# EAGLE schematic CrowPanel Pico Display-3.5_V1.0-240412 (EAGLE 9.6.2)
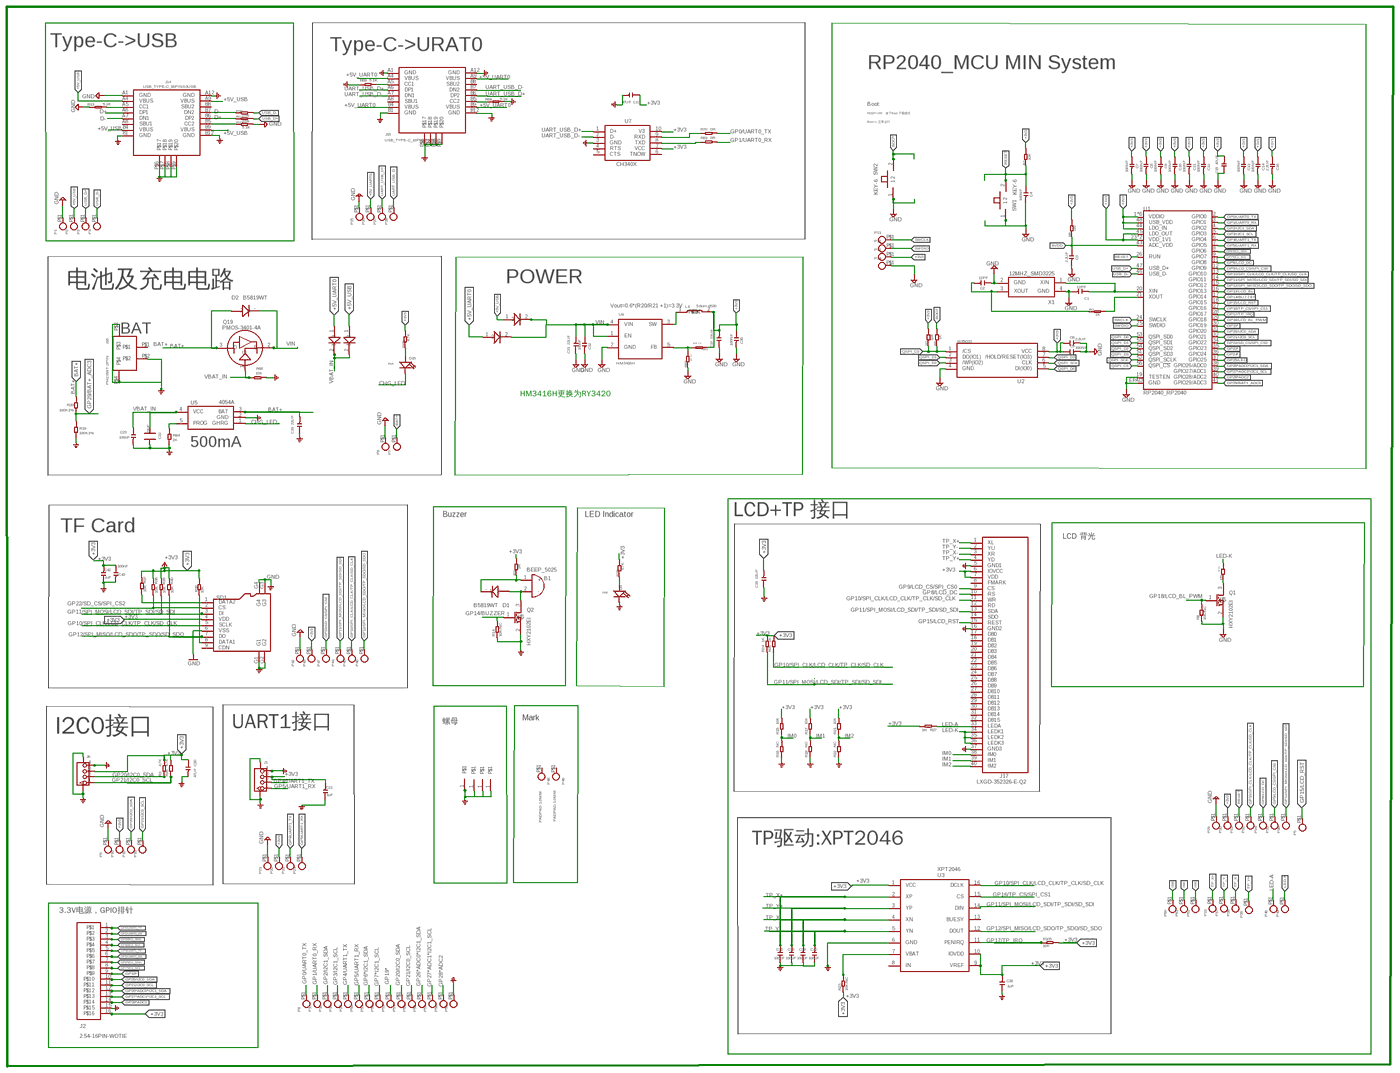
[diagram p0: schematic, sheet 1, overview]
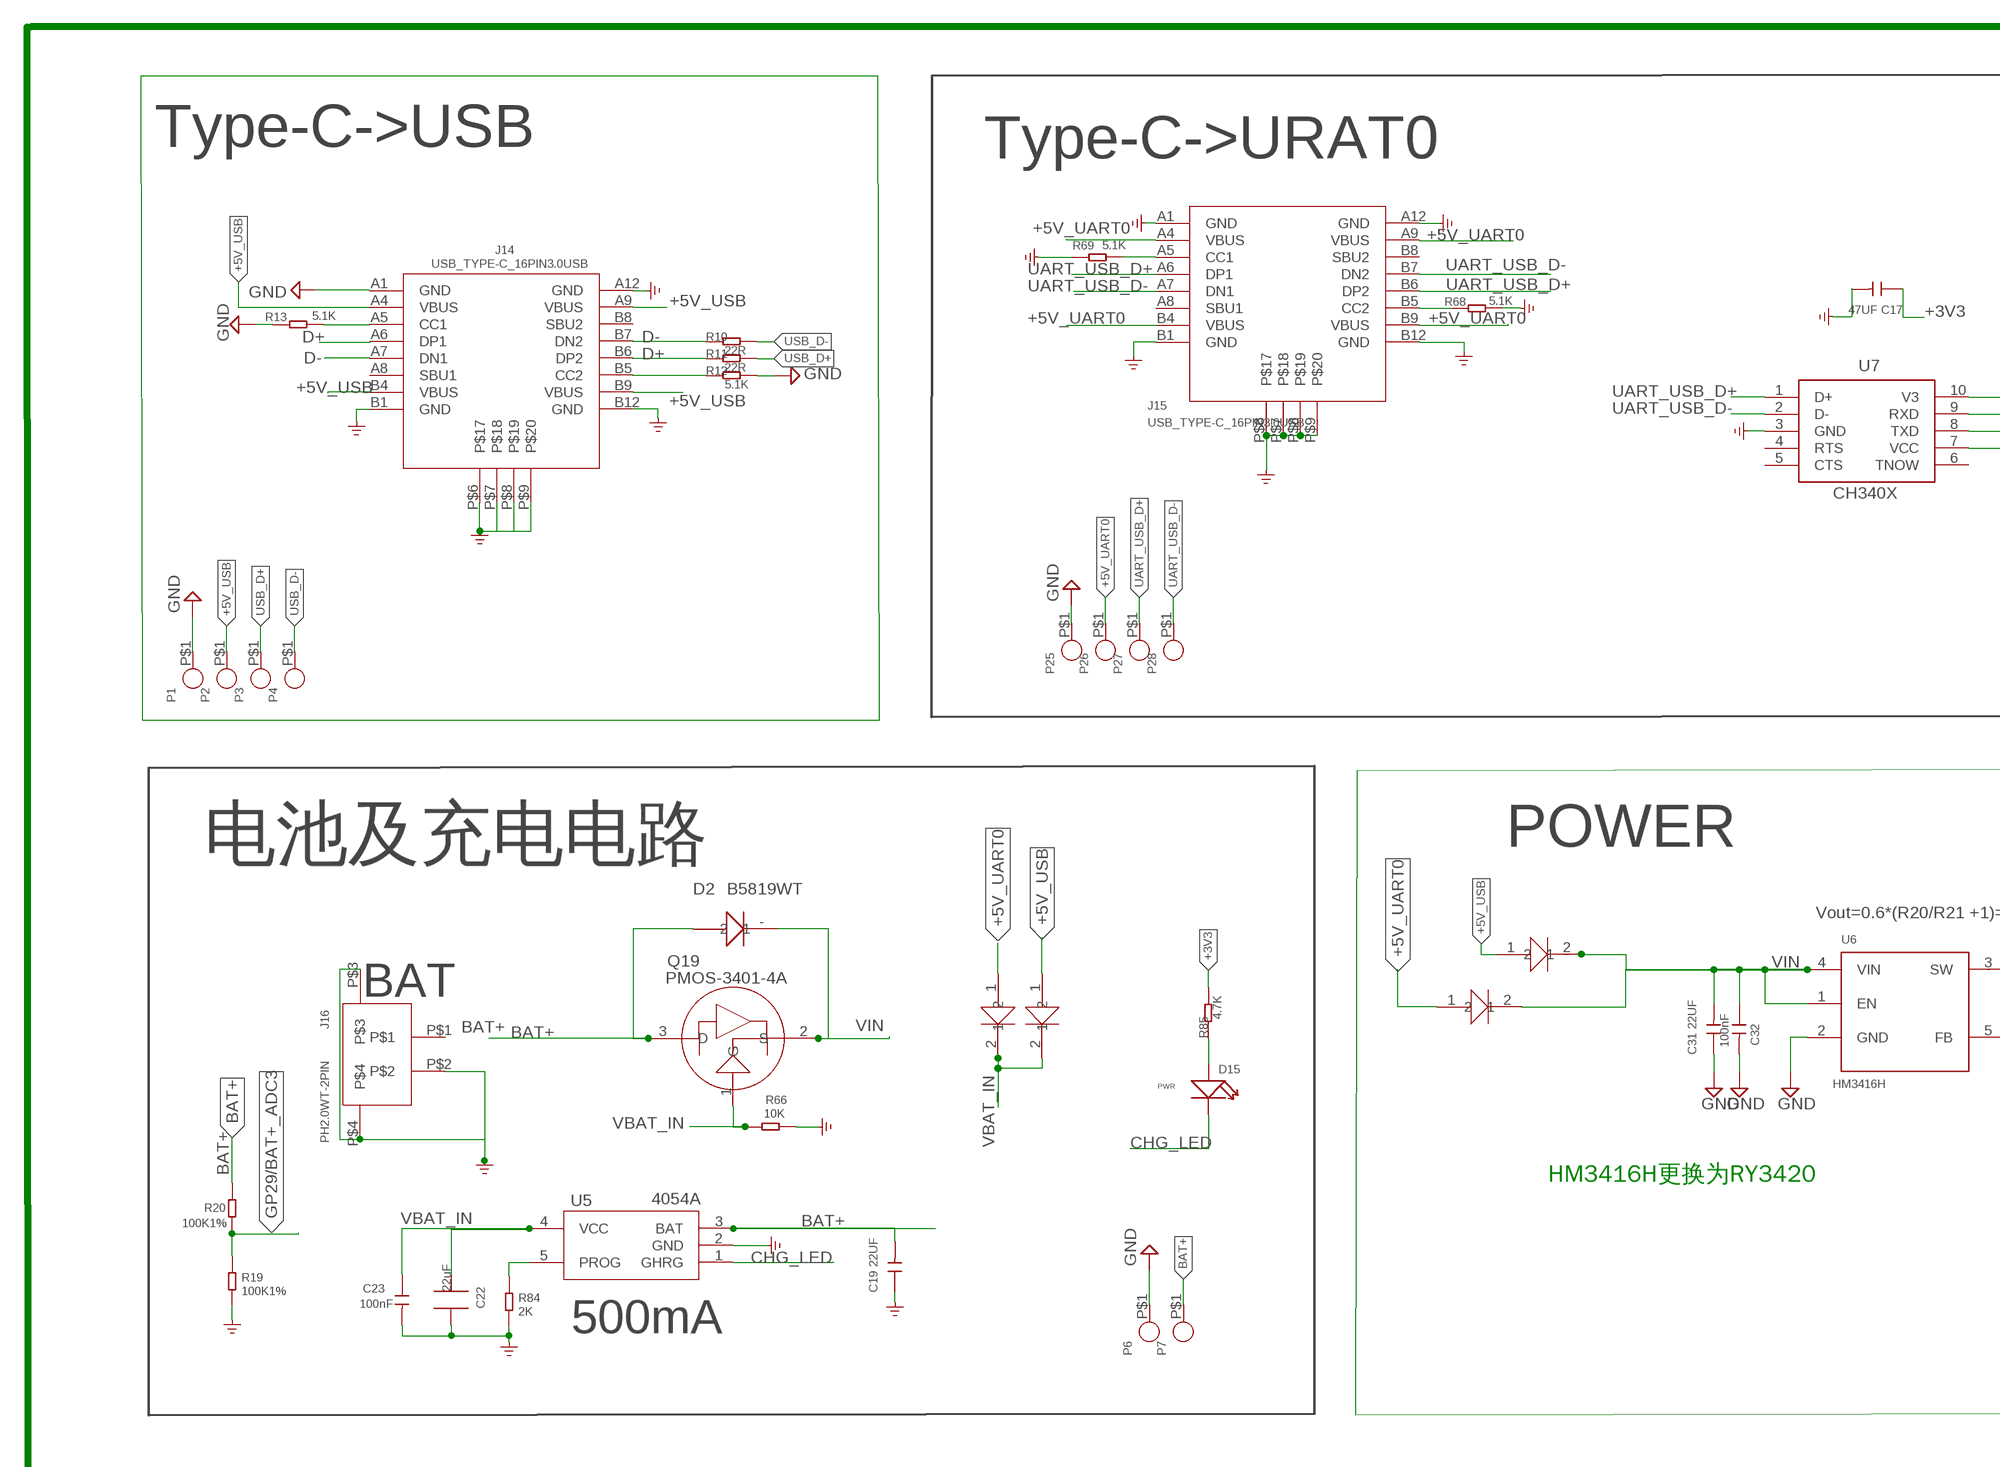
[diagram p1: schematic, sheet 1, part 1 of 4]
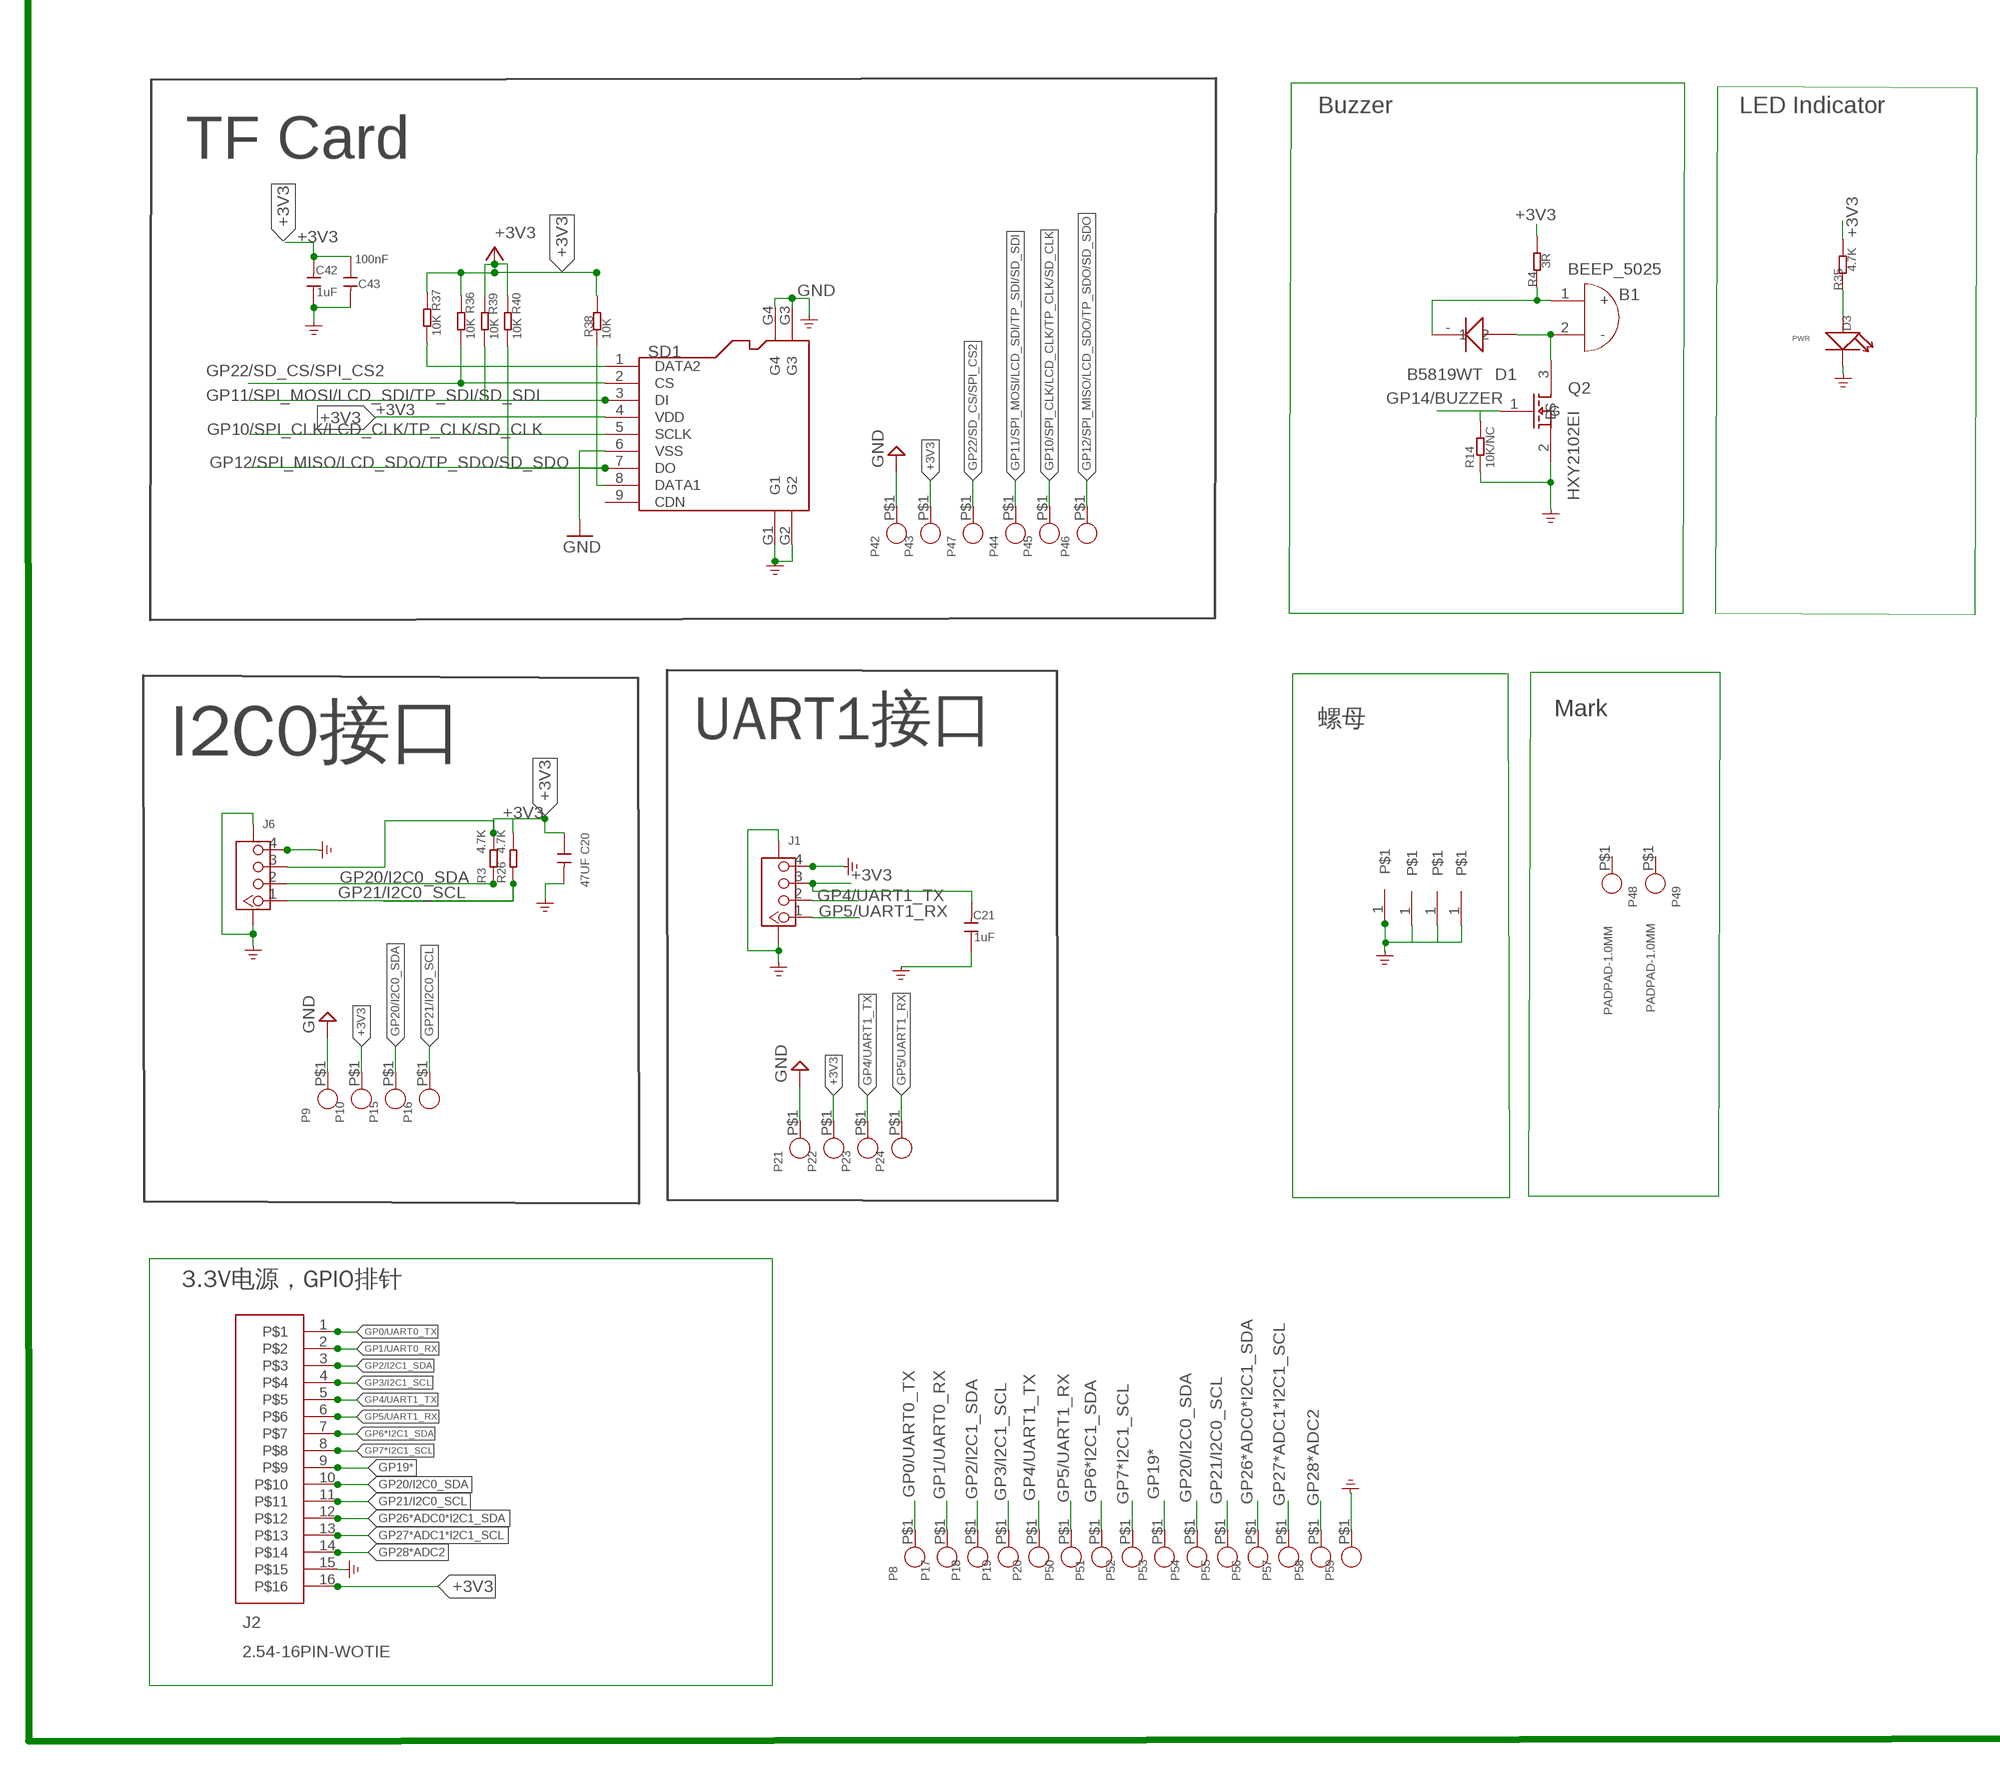
[diagram p2: schematic, sheet 1, part 2 of 4]
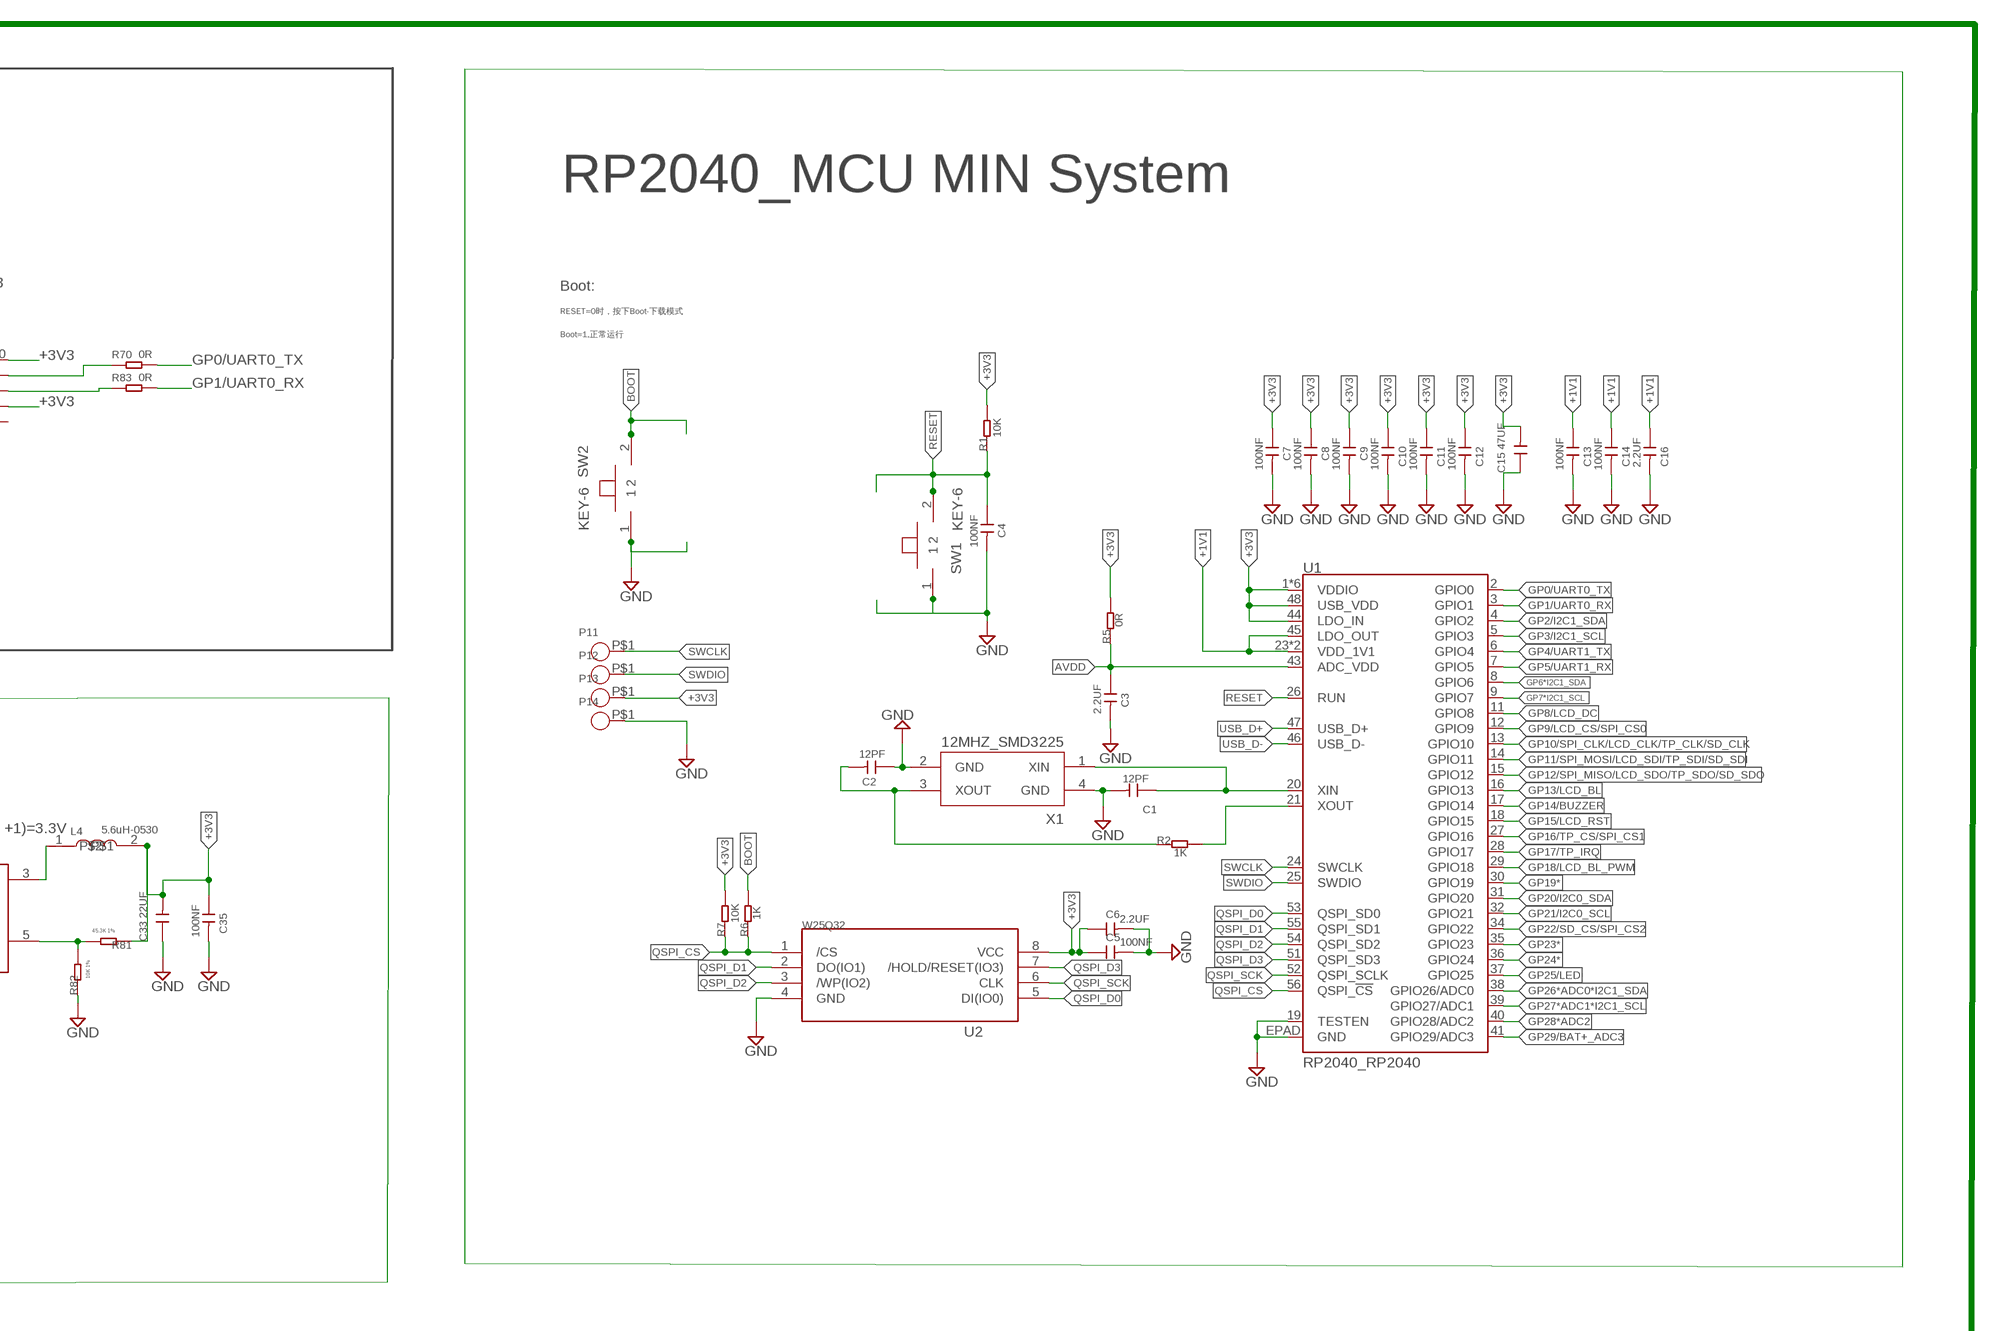
[diagram p3: schematic, sheet 1, part 3 of 4]
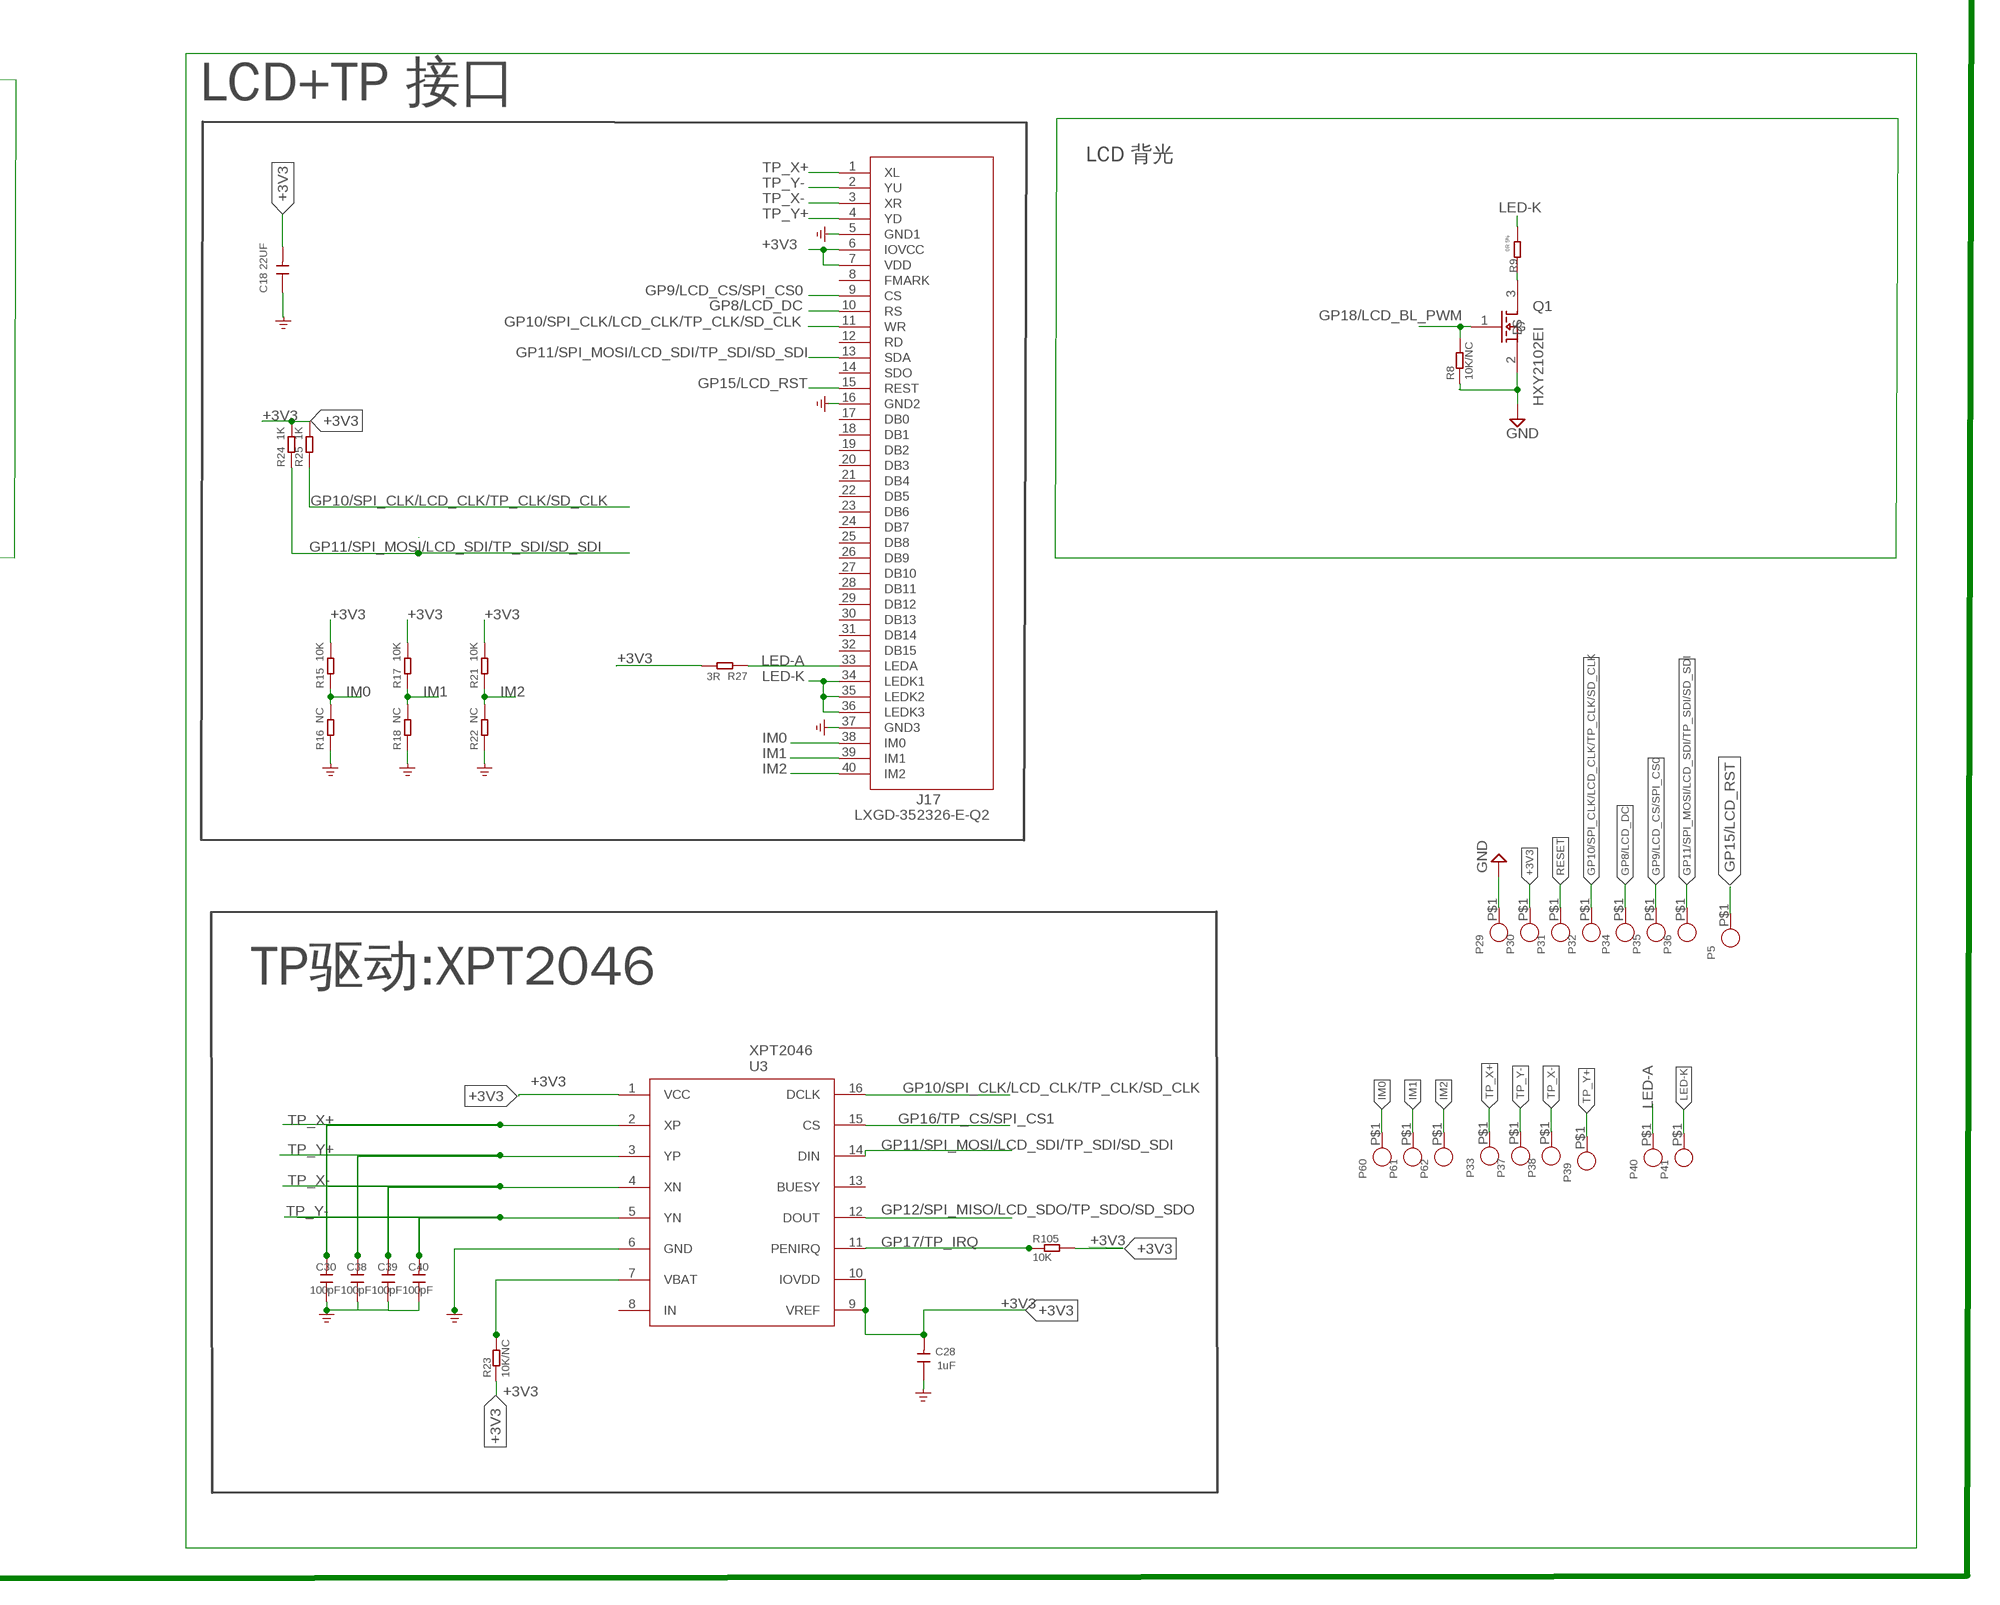
[diagram p4: schematic, sheet 1, part 4 of 4]

## Parts
B1  BEEP_5025  [BEEP_5025]
C1  12PF  A_XBJ_C0603  [A_XBJ_0603]
C2  12PF  A_XBJ_C0603  [A_XBJ_0603]
C3  2.2UF  A_XBJ_C0603  [A_XBJ_0603]
C4  100NF  A_XBJ_C0603  [A_XBJ_0603]
C5  100NF  A_XBJ_C0603  [A_XBJ_0603]
C6  2.2UF  A_XBJ_C0603  [A_XBJ_0603]
C7  100NF  A_XBJ_C0603  [A_XBJ_0603]
C8  100NF  A_XBJ_C0603  [A_XBJ_0603]
C9  100NF  A_XBJ_C0603  [A_XBJ_0603]
C10  100NF  A_XBJ_C0603  [A_XBJ_0603]
C11  100NF  A_XBJ_C0603  [A_XBJ_0603]
C12  100NF  A_XBJ_C0603  [A_XBJ_0603]
C13  100NF  A_XBJ_C0603  [A_XBJ_0603]
C14  100NF  A_XBJ_C0603  [A_XBJ_0603]
C15  47UF  A_XBJ_C0805  [A_XBJ_0805]
C16  2.2UF  A_XBJ_C0603  [A_XBJ_0603]
C17  47UF  A_XBJ_C0805  [A_XBJ_0805]
C18  22UF  A_XBJ_C0805  [A_XBJ_0805]
C19  22UF  A_XBJ_C0805  [A_XBJ_0805]
C20  47UF  A_XBJ_C0805  [A_XBJ_0805]
C21  1uF  DISCRETE_C-0603  [DISCRETE_C0603]
C22  22uF  C0805_S  [0805_S]
C23  100nF  C-0603  [C0603]
C28  1uF  DISCRETE_C-0603  [DISCRETE_C0603]
C30  100pF  C0603  [0603]
C31  22UF  A_XBJ_C0805  [A_XBJ_0805]
C32  100nF  A_XBJ_C0603  [A_XBJ_0603]
C33  22UF  A_XBJ_C0805  [A_XBJ_0805]
C35  100NF  A_XBJ_C0603  [A_XBJ_0603]
C38  100pF  C0603  [0603]
C39  100pF  C0603  [0603]
C40  100pF  C0603  [0603]
C42  1uF  DISCRETE_C-0603  [DISCRETE_C0603]
C43  100nF  C-0603  [C0603]
D1  B5819WT  DIODE_W  [SOD-523]
D2  B5819WT  DIODE_W  [SOD-523]
D3  DISCRETE_007-LED0603  [DISCRETE_D0603]
D4  SOD-323  [SOD-323]
D5  SOD-323  [SOD-323]
D6  SOD-323  [SOD-323]
D8  SOD-323  [SOD-323]
D15  DISCRETE_007-LED0603  [DISCRETE_D0603]
J1  CONNECTOR_TWIG-4P-2.0-SMD-FEMALE-REINFORCE90D  [CONNECTOR_4P-SMD-2.0-90D]
J2  2.54-16PIN-WOTIE  [2.54-16P-WOTIE]
J6  CONNECTOR_TWIG-4P-2.0-SMD-FEMALE-REINFORCE90D  [CONNECTOR_4P-SMD-2.0-90D]
J14  USB_TYPE-C_16PIN3.0USB  [KEVIN_3.0TYPEC-SMD]
J15  USB_TYPE-C_16PIN3.0USB  [KEVIN_3.0TYPEC-SMD]
J16  PH2.0WT-2PIN  [PH2.0WT-2PIN]
J17  LXGD-352326-E-Q2  LXGD-28A1044-E-T2  [40PIN-0.5MM]
L4  5.6uH-0530  L-0530  [CD54_CD54]
P1  CROWPI_POW_PADPAD-1.0MM  [CROWPI_POW_PAD-1.0MM]
P2  CROWPI_POW_PADPAD-1.0MM  [CROWPI_POW_PAD-1.0MM]
P3  CROWPI_POW_PADPAD-1.0MM  [CROWPI_POW_PAD-1.0MM]
P4  CROWPI_POW_PADPAD-1.0MM  [CROWPI_POW_PAD-1.0MM]
P5  CROWPI_POW_PADPAD-1.0MM  [CROWPI_POW_PAD-1.0MM]
P6  CROWPI_POW_PADPAD-1.0MM  [CROWPI_POW_PAD-1.0MM]
P7  CROWPI_POW_PADPAD-1.0MM  [CROWPI_POW_PAD-1.0MM]
P8  CROWPI_POW_PADPAD-1.0MM  [CROWPI_POW_PAD-1.0MM]
P9  CROWPI_POW_PADPAD-1.0MM  [CROWPI_POW_PAD-1.0MM]
P10  CROWPI_POW_PADPAD-1.0MM  [CROWPI_POW_PAD-1.0MM]
P11  CROWPI_POW_PADPAD-1.0MM  [CROWPI_POW_PAD-1.0MM]
P12  CROWPI_POW_PADPAD-1.0MM  [CROWPI_POW_PAD-1.0MM]
P13  CROWPI_POW_PADPAD-1.0MM  [CROWPI_POW_PAD-1.0MM]
P14  CROWPI_POW_PADPAD-1.0MM  [CROWPI_POW_PAD-1.0MM]
P15  CROWPI_POW_PADPAD-1.0MM  [CROWPI_POW_PAD-1.0MM]
P16  CROWPI_POW_PADPAD-1.0MM  [CROWPI_POW_PAD-1.0MM]
P17  CROWPI_POW_PADPAD-1.0MM  [CROWPI_POW_PAD-1.0MM]
P18  CROWPI_POW_PADPAD-1.0MM  [CROWPI_POW_PAD-1.0MM]
P19  CROWPI_POW_PADPAD-1.0MM  [CROWPI_POW_PAD-1.0MM]
P20  CROWPI_POW_PADPAD-1.0MM  [CROWPI_POW_PAD-1.0MM]
P21  CROWPI_POW_PADPAD-1.0MM  [CROWPI_POW_PAD-1.0MM]
P22  CROWPI_POW_PADPAD-1.0MM  [CROWPI_POW_PAD-1.0MM]
P23  CROWPI_POW_PADPAD-1.0MM  [CROWPI_POW_PAD-1.0MM]
P24  CROWPI_POW_PADPAD-1.0MM  [CROWPI_POW_PAD-1.0MM]
P25  CROWPI_POW_PADPAD-1.0MM  [CROWPI_POW_PAD-1.0MM]
P26  CROWPI_POW_PADPAD-1.0MM  [CROWPI_POW_PAD-1.0MM]
P27  CROWPI_POW_PADPAD-1.0MM  [CROWPI_POW_PAD-1.0MM]
P28  CROWPI_POW_PADPAD-1.0MM  [CROWPI_POW_PAD-1.0MM]
P29  CROWPI_POW_PADPAD-1.0MM  [CROWPI_POW_PAD-1.0MM]
P30  CROWPI_POW_PADPAD-1.0MM  [CROWPI_POW_PAD-1.0MM]
P31  CROWPI_POW_PADPAD-1.0MM  [CROWPI_POW_PAD-1.0MM]
P32  CROWPI_POW_PADPAD-1.0MM  [CROWPI_POW_PAD-1.0MM]
P33  CROWPI_POW_PADPAD-1.0MM  [CROWPI_POW_PAD-1.0MM]
P34  CROWPI_POW_PADPAD-1.0MM  [CROWPI_POW_PAD-1.0MM]
P35  CROWPI_POW_PADPAD-1.0MM  [CROWPI_POW_PAD-1.0MM]
P36  CROWPI_POW_PADPAD-1.0MM  [CROWPI_POW_PAD-1.0MM]
P37  CROWPI_POW_PADPAD-1.0MM  [CROWPI_POW_PAD-1.0MM]
P38  CROWPI_POW_PADPAD-1.0MM  [CROWPI_POW_PAD-1.0MM]
P39  CROWPI_POW_PADPAD-1.0MM  [CROWPI_POW_PAD-1.0MM]
P40  CROWPI_POW_PADPAD-1.0MM  [CROWPI_POW_PAD-1.0MM]
P41  CROWPI_POW_PADPAD-1.0MM  [CROWPI_POW_PAD-1.0MM]
P42  CROWPI_POW_PADPAD-1.0MM  [CROWPI_POW_PAD-1.0MM]
P43  CROWPI_POW_PADPAD-1.0MM  [CROWPI_POW_PAD-1.0MM]
P44  CROWPI_POW_PADPAD-1.0MM  [CROWPI_POW_PAD-1.0MM]
P45  CROWPI_POW_PADPAD-1.0MM  [CROWPI_POW_PAD-1.0MM]
P46  CROWPI_POW_PADPAD-1.0MM  [CROWPI_POW_PAD-1.0MM]
P47  CROWPI_POW_PADPAD-1.0MM  [CROWPI_POW_PAD-1.0MM]
P48  PADPAD-1.0MM  [PAD-1.0MM]
P49  PADPAD-1.0MM  [PAD-1.0MM]
P50  CROWPI_POW_PADPAD-1.0MM  [CROWPI_POW_PAD-1.0MM]
P51  CROWPI_POW_PADPAD-1.0MM  [CROWPI_POW_PAD-1.0MM]
P52  CROWPI_POW_PADPAD-1.0MM  [CROWPI_POW_PAD-1.0MM]
P53  CROWPI_POW_PADPAD-1.0MM  [CROWPI_POW_PAD-1.0MM]
P54  CROWPI_POW_PADPAD-1.0MM  [CROWPI_POW_PAD-1.0MM]
P55  CROWPI_POW_PADPAD-1.0MM  [CROWPI_POW_PAD-1.0MM]
P56  CROWPI_POW_PADPAD-1.0MM  [CROWPI_POW_PAD-1.0MM]
P57  CROWPI_POW_PADPAD-1.0MM  [CROWPI_POW_PAD-1.0MM]
P58  CROWPI_POW_PADPAD-1.0MM  [CROWPI_POW_PAD-1.0MM]
P59  CROWPI_POW_PADPAD-1.0MM  [CROWPI_POW_PAD-1.0MM]
P60  CROWPI_POW_PADPAD-1.0MM  [CROWPI_POW_PAD-1.0MM]
P61  CROWPI_POW_PADPAD-1.0MM  [CROWPI_POW_PAD-1.0MM]
P62  CROWPI_POW_PADPAD-1.0MM  [CROWPI_POW_PAD-1.0MM]
Q1  HXY2102EI  [SOT-323_W]
Q2  HXY2102EI  [SOT-323_W]
Q19  PMOS-3401-4A  P-MOS-SOT23  [SOT-23]
R1  10K  DISCRETE_R-0603  [DISCRETE_R0603]
R2  1K  DISCRETE_R-0603  [DISCRETE_R0603]
R3  4.7K  DISCRETE_R-0603  [DISCRETE_R0603]
R4  3R  DISCRETE_R-0603  [DISCRETE_R0603]
R5  0R  DISCRETE_R-0603  [DISCRETE_R0603]
R6  1K  DISCRETE_R-0603  [DISCRETE_R0603]
R7  10K  DISCRETE_R-0603  [DISCRETE_R0603]
R8  10K/NC  DISCRETE_R-0603  [DISCRETE_R0603]
R9  0R 5%  DISCRETE_R-0603  [DISCRETE_R0603]
R10  22R  DISCRETE_R-0603  [DISCRETE_R0603]
R11  22R  DISCRETE_R-0603  [DISCRETE_R0603]
R12  5.1K  DISCRETE_R-0603  [DISCRETE_R0603]
R13  5.1K  DISCRETE_R-0603  [DISCRETE_R0603]
R14  10K/NC  DISCRETE_R-0603  [DISCRETE_R0603]
R15  10K  DISCRETE_R-0603  [DISCRETE_R0603]
R16  NC  DISCRETE_R-0603  [DISCRETE_R0603]
R17  10K  DISCRETE_R-0603  [DISCRETE_R0603]
R18  NC  DISCRETE_R-0603  [DISCRETE_R0603]
R19  100K1%  DISCRETE_R-0603  [DISCRETE_R0603]
R20  100K1%  DISCRETE_R-0603  [DISCRETE_R0603]
R21  10K  DISCRETE_R-0603  [DISCRETE_R0603]
R22  NC  DISCRETE_R-0603  [DISCRETE_R0603]
R23  10K/NC  DISCRETE_R-0603  [DISCRETE_R0603]
R24  1K  DISCRETE_R-0603  [DISCRETE_R0603]
R25  1K  DISCRETE_R-0603  [DISCRETE_R0603]
R26  4.7K  DISCRETE_R-0603  [DISCRETE_R0603]
R27  3R  DISCRETE_R-0603  [DISCRETE_R0603]
R35  4.7K  DISCRETE_R-0603  [DISCRETE_R0603]
R36  10K  DISCRETE_R-0603  [DISCRETE_R0603]
R37  10K  DISCRETE_R-0603  [DISCRETE_R0603]
R38  10K  DISCRETE_R-0603  [DISCRETE_R0603]
R39  10K  DISCRETE_R-0603  [DISCRETE_R0603]
R40  10K  DISCRETE_R-0603  [DISCRETE_R0603]
R66  10K  DISCRETE_R-0603  [DISCRETE_R0603]
R68  5.1K  DISCRETE_R-0603  [DISCRETE_R0603]
R69  5.1K  DISCRETE_R-0603  [DISCRETE_R0603]
R70  0R  DISCRETE_R-0603  [DISCRETE_R0603]
R81  45.3K 1%  DISCRETE_R-0603  [DISCRETE_R0603]
R82  10K 1%  DISCRETE_R-0603  [DISCRETE_R0603]
R83  0R  DISCRETE_R-0603  [DISCRETE_R0603]
R84  2K  DISCRETE_R-0603  [DISCRETE_R0603]
R85  4.7K  DISCRETE_R-0603  [DISCRETE_R0603]
R105  10K  DISCRETE_R-0603  [DISCRETE_R0603]
SD1  HOLDER-MICROSD-9P  [9P-SMD-W/-RING]
SW1  KEY-6  [KEY-6]
SW2  KEY-6  [KEY-6]
T1  3M-5  [3M-5]
T2  3M-5  [3M-5]
T3  3M-5  [3M-5]
T4  3M-5  [3M-5]
U1  RP2040_RP2040  [RP2040_QFN-56]
U2  SELF_W25Q128JV  [SELF_SOIC-8-208MIL]
U3  XPT2046  [XP2046-SSOP16]
U5  4054A  [SOP23-5]
U6  HM3416H  CROWBOT_-V1.0-20220525_A_XBJ_HM3420B  [CROWBOT_-V1.0-20220525_A_XBJ_SOT23-5]
U7  CH340X  CH340E  [MSOP-10_W]
X1  12MHZ_SMD3225  A_XBJ_XTAL  [A_XBJ_SMD3225]

## Nets
+1V1: C13.1 C14.1 C16.1 U1.23(VDD_1V1) U1.45(LDO_OUT) U1.50(VDD_1V1)
+3V3: C5.1 C6.1 C7.1 C8.1 C9.1 C10.1 C11.1 C12.1 C15.2 C17.1 C18.2 C20.1 C21.2 C28.2 C33.2 C35.1 C42.2 C43.1 J1.3 J2.16 J6.3 J17.6(IOVCC) J17.7(VDD) L4.2 P10.P$1 P13.P$1 P22.P$1 P30.P$1 P43.P$1 R1.2 R3.2 R4.2 R5.2 R7.2 R15.2 R17.2 R21.2 R23.1 R24.2 R25.2 R26.2 R27.2 R35.2 R36.1 R37.1 R38.1 R39.1 R40.1 R81.1 R85.2 R105.2 SD1.4(VDD) U1.1(VDDIO) U1.10(VDDIO) U1.22(VDDIO) U1.33(VDDIO) U1.42(VDDIO) U1.44(LDO_IN) U1.48(USB_VDD) U1.49(VDDIO) U2.8(VCC) U3.1(VCC) U3.9(VREF) U3.10(IOVDD) U7.7(VCC) U7.10(V3)
+5V_UART0 [PWR]: D4.1 D8.1 J15.A4(VBUS) J15.A9(VBUS) J15.B4(VBUS) J15.B9(VBUS) P26.P$1
+5V_USB [PWR]: D5.1 D6.1 J14.A4(VBUS) J14.A9(VBUS) J14.B4(VBUS) J14.B9(VBUS) P2.P$1
AVDD: C3.1 R5.1 U1.43(ADC_VDD)
BAT+: C19.2 D2.+ J16.P$1 P7.P$1 Q19.3(D) R20.1 U5.3(BAT)
BOOT: R6.2 SW2.2
CHG_LED: D15.- U5.1(GHRG)
D+ [USB]: J14.A6(DP1) J14.B6(DP2) R11.1
D- [USB]: J14.A7(DN1) J14.B7(DN2) R10.1
GND [GND]: C1.2 C2.1 C3.2 C4.2 C5.2 C6.2 C7.2 C8.2 C9.2 C10.2 C11.2 C12.2 C13.2 C14.2 C15.1 C16.2 C17.2 C18.1 C19.1 C20.2 C21.1 C22.1 C23.2 C28.1 C30.1 C31.1 C32.2 C33.1 C35.2 C38.1 C39.1 C40.1 C42.1 C43.2 D3.- J1.4 J1.SS1 J1.SS2 J2.15 J6.4 J6.SS1 J6.SS2 J14.A1(GND) J14.A12(GND) J14.B1(GND) J14.B12(GND) J14.P$6 J14.P$7 J14.P$8 J14.P$9 J15.A1(GND) J15.A12(GND) J15.B1(GND) J15.B12(GND) J15.P$6 J15.P$7 J15.P$8 J15.P$9 J16.P$2 J16.P$3 J16.P$4 J17.5(GND1) J17.16(GND2) J17.37(GND3) P1.P$1 P6.P$1 P9.P$1 P14.P$1 P21.P$1 P25.P$1 P29.P$1 P42.P$1 P59.P$1 Q1.2(S) Q2.2(S) R8.1 R12.2 R13.1 R14.1 R16.1 R18.1 R19.2 R22.1 R66.1 R68.2 R69.1 R82.1 R84.2 SD1.6(VSS) SD1.G1 SD1.G2 SD1.G3 SD1.G4 SW1.1 SW2.1 T1.1 T2.1 T3.1 T4.1 U1.19(TESTEN) U1.EPAD(GND) U2.4(GND) U3.6(GND) U5.2(GND) U6.2(GND) U7.3(GND) X1.2(GND) X1.4(GND)
GP0/UART0_TX: J2.1 P8.P$1 R70.2 U1.2(GPIO0)
GP1/UART0_RX: J2.2 P17.P$1 R83.2 U1.3(GPIO1)
GP2/I2C1_SDA: J2.3 P18.P$1 U1.4(GPIO2)
GP3/I2C1_SCL: J2.4 P19.P$1 U1.5(GPIO3)
GP4/UART1_TX: J1.2 J2.5 P20.P$1 P23.P$1 U1.6(GPIO4)
GP5/UART1_RX: J1.1 J2.6 P24.P$1 P50.P$1 U1.7(GPIO5)
GP6*I2C1_SDA: J2.7 P51.P$1 U1.8(GPIO6)
GP7*I2C1_SCL: J2.8 P52.P$1 U1.9(GPIO7)
GP8/LCD_DC: J17.10(RS) P34.P$1 U1.11(GPIO8)
GP9/LCD_CS/SPI_CS0: J17.9(CS) P35.P$1 U1.12(GPIO9)
GP10/SPI_CLK/LCD_CLK/TP_CLK/SD_CLK: J17.11(WR) P32.P$1 P45.P$1 R25.1 SD1.5(SCLK) U1.13(GPIO10) U3.16(DCLK)
GP11/SPI_MOSI/LCD_SDI/TP_SDI/SD_SDI: J17.13(SDA) P36.P$1 P44.P$1 R24.1 R39.2 SD1.3(DI) U1.14(GPIO11) U3.14(DIN)
GP12/SPI_MISO/LCD_SDO/TP_SDO/SD_SDO: P46.P$1 R40.2 SD1.7(DO) U1.15(GPIO12) U3.12(DOUT)
GP13/LCD_BL: U1.16(GPIO13)
GP14/BUZZER: Q2.1(G) R14.2 U1.17(GPIO14)
GP15/LCD_RST: J17.15(REST) P5.P$1 U1.18(GPIO15)
GP16/TP_CS/SPI_CS1: U1.27(GPIO16) U3.15(CS)
GP17/TP_IRQ: R105.1 U1.28(GPIO17) U3.11(PENIRQ)
GP18/LCD_BL_PWM: Q1.1(G) R8.2 U1.29(GPIO18)
GP19*: J2.9 P53.P$1 U1.30(GPIO19)
GP20/I2C0_SDA: J2.10 J6.2 P15.P$1 P54.P$1 R3.1 U1.31(GPIO20)
GP21/I2C0_SCL: J2.11 J6.1 P16.P$1 P55.P$1 R26.1 U1.32(GPIO21)
GP22/SD_CS/SPI_CS2: P47.P$1 R36.2 SD1.2(CS) U1.34(GPIO22)
GP23*: U1.35(GPIO23)
GP24*: U1.36(GPIO24)
GP25/LED: U1.37(GPIO25)
GP26*ADC0*I2C1_SDA: J2.12 P56.P$1 U1.38(GPIO26/ADC0)
GP27*ADC1*I2C1_SCL: J2.13 P57.P$1 U1.39(GPIO27/ADC1)
GP28*ADC2: J2.14 P58.P$1 U1.40(GPIO28/ADC2)
GP29/BAT+_ADC3: R19.1 R20.2 U1.41(GPIO29/ADC3)
IM0: J17.38(IM0) P60.P$1 R15.1 R16.2
IM1: J17.39(IM1) P61.P$1 R17.1 R18.2
IM2: J17.40(IM2) P62.P$1 R21.1 R22.2
LED-A: J17.33(LEDA) P40.P$1 R27.1
LED-K: J17.34(LEDK1) J17.35(LEDK2) J17.36(LEDK3) P41.P$1 R9.2
N$1: C2.2 R2.1 X1.3(XOUT)
N$2: R2.2 U1.21(XOUT)
N$3: C1.1 U1.20(XIN) X1.1(XIN)
N$4: B1.1(+) D1.- R4.1
N$5: J15.B5(CC2) R68.1
N$6: B1.2(-) D1.+ Q2.3(D)
N$7: Q1.3(D) R9.1
N$9: R84.1 U5.5(PROG)
N$10: L4.1 U6.3(SW)
N$14: J14.A5(CC1) R13.2
N$15: D15.+ R85.1
N$16: J15.A5(CC1) R69.2
N$19: J14.B5(CC2) R12.1
N$20: R23.2 U3.7(VBAT)
N$22: R37.2 SD1.1(DATA2)
N$24: R38.2 SD1.8(DATA1)
N$28: R70.1 U7.9(RXD)
N$31: R83.1 U7.8(TXD)
N$35: D3.+ R35.1
N$43: R81.2 R82.2 U6.5(FB)
QSPI_CS: R6.1 R7.1 U1.56(QSPI_!CS!) U2.1(/CS)
QSPI_D0: U1.53(QSPI_SD0) U2.5(DI(IO0))
QSPI_D1: U1.55(QSPI_SD1) U2.2(DO(IO1))
QSPI_D2: U1.54(QSPI_SD2) U2.3(/WP(IO2))
QSPI_D3: U1.51(QSPI_SD3) U2.7(/HOLD/RESET(IO3))
QSPI_SCK: U1.52(QSPI_SCLK) U2.6(CLK)
RESET: C4.1 P31.P$1 R1.1 SW1.2 U1.26(RUN)
SWCLK: P11.P$1 U1.24(SWCLK)
SWDIO: P12.P$1 U1.25(SWDIO)
TP_X+: C30.2 J17.1(XL) P33.P$1 U3.2(XP)
TP_X-: C39.2 J17.3(XR) P38.P$1 U3.4(XN)
TP_Y+: C38.2 J17.4(YD) P39.P$1 U3.3(YP)
TP_Y-: C40.2 J17.2(YU) P37.P$1 U3.5(YN)
UART_USB_D+ [USB]: J15.A6(DP1) J15.B6(DP2) P27.P$1 U7.1(D+)
UART_USB_D- [USB]: J15.A7(DN1) J15.B7(DN2) P28.P$1 U7.2(D-)
USB_D+ [USB]: P3.P$1 R11.2 U1.47(USB_D+)
USB_D- [USB]: P4.P$1 R10.2 U1.46(USB_D-)
VBAT_IN: C22.2 C23.1 D4.2 D5.2 Q19.1(G) R66.2 U5.4(VCC)
VIN [PWR]: C31.2 C32.1 D2.- D6.2 D8.2 Q19.2(S) U6.1(EN) U6.4(VIN)
Unconnected: J14.A8(SBU1) J14.B8(SBU2) J15.A8(SBU1) J15.B8(SBU2) J17.8(FMARK) J17.12(RD) J17.14(SDO) J17.17(DB0) J17.18(DB1) J17.19(DB2) J17.20(DB3) J17.21(DB4) J17.22(DB5) J17.23(DB6) J17.24(DB7) J17.25(DB8) J17.26(DB9) J17.27(DB10) J17.28(DB11) J17.29(DB12) J17.30(DB13) J17.31(DB14) J17.32(DB15) P48.P$1 P49.P$1 SD1.9(CDN) U3.8(IN) U3.13(BUESY) U7.4(RTS) U7.5(CTS) U7.6(TNOW)

## Notes on the sheet
- Type-C->USB | Type-C->URAT0
- RP2040_MCU MIN System
- Boot:
- RESET=0时，按下Boot-下载模式
- Boot=1,正常运行
- 电池及充电电路 | POWER
- Vout=0.6*(R20/R21 +1)=3.3V
- BAT
- W25Q32
- PWR
- HM3416H更换为RY3420
- 500mA
- Buzzer | LED Indicator | LCD+TP 接口
- TF Card
- LCD 背光
- PWR
- Mark
- 螺母
- I2C0接口 | UART1接口
- TP驱动:XPT2046
- 3.3V电源，GPIO排针

## Library data of the parts
B1 = WGH:BEEP_5025
C1-C14 C16 C32 C35 = CrowBot_V1.4:A_XBJ_C0603
C15 C17-C20 C31 C33 = CrowBot_V1.4:A_XBJ_C0805
C21 C28 C42 = A_xbj:DISCRETE_C*: Ceramic Capacitors
C22 = CPT_SMD:C0805
C23 C43 = discrete:C*: Ceramic Capacitors
C30 C38-C40 = A_xbj:C0603
D1 D2 = WGH:DIODE_W
D3 D15 = Crowtail_SIM1606:DISCRETE_007-LED*
D4-D6 D8 = Pico-2.4:SOD-323
J1 J6 = A_xbj:CONNECTOR_TWIG-4P-2.0-SMD-FEMALE-REINFORCE
J2 = WGH:2.54-16PIN-WOTIE
J14 J15 = WZ3532R024-ESP32-V0.1-20221226:USB_TYPE-C_16PIN
J16 = cooper:PH2.0WT-2PIN
J17 = WGH:LXGD-28A1044-E-T2
L4 = WZ2432R028-ESP32-V1.2-20231108:L-0530
P1-P47 P50-P62 = CrowBot_V1.4:CROWPI_POW_PAD*
P48 P49 = crowpi_pow:PAD*
Q1 Q2 = WGH:HXY2102EI
Q19 = DFN8:P-MOS-SOT23
R1 R2 R4-R7 R9-R13 R35 R81 R82 R85 = Lora_RA-08H_Dev:DISCRETE_R*
R3 R15-R18 R21 R22 R24-R27 R36-R40 R68-R70 R83 = Crowtail-_LED-V2.0-20190615-01:DISCRETE_R*
R8 R14 R19 R20 R23 R66 R84 R105 = A9G:DISCRETE_R*
SD1 = Connector:HOLDER-MICROSD-9P
SW1 SW2 = WGH:KEY-6
T1-T4 = DW1000:3M-5
U1 = Lora_RA-08H_Dev:RP2040_RP2040: Raspberry Pi RP2040 MCU 56-pin 32-bit Microcontroller with 264kB of SRAM and external flash support up to 16MB Getting Started with the RP2040 <https://pico.raspberrypi.org/getting-started/> Dual-core ARM Cortex M0+ processor, flexible clock running up to 133 MHz 264kB of SRAM, and QSPI control of common flash memory USB 1.1 Host and Device support Low-power sleep and dormant modes Drag & drop programming using mass storage over USB 26 multi-function GPIO pins 2×SPI, 2×I2C, 2×UART, 3×12-bit ADC, 16×controllable PWM channels Accurate clock and timer on-chip Temperature sensor Accelerated floating point libraries on-chip 8×Programmable IO (PIO) state machines for custom peripheral support; PROD_ID: IC-15502
U2 = Lora_RA-08H_Dev:SELF_W25Q128JV
U3 = cooper:XPT2046
U5 = DFN8:4054A
U6 = CrowBot_V1.4:CROWBOT_-V1.0-20220525_A_XBJ_HM3420B
U7 = WGH:CH340E
X1 = CrowBot_V1.4:A_XBJ_XTAL

## Net classes
1 PWR: width 0.254 mm
2 GND: width 0.203 mm
3 RS485: width 0.203 mm, clearance 0.203 mm
4 USB: width 0.203 mm, clearance 0.152 mm
5 ANT: width 0.889 mm, clearance 0.203 mm